# EAGLE design Spectrum_Shield (EAGLE 7.1.0)
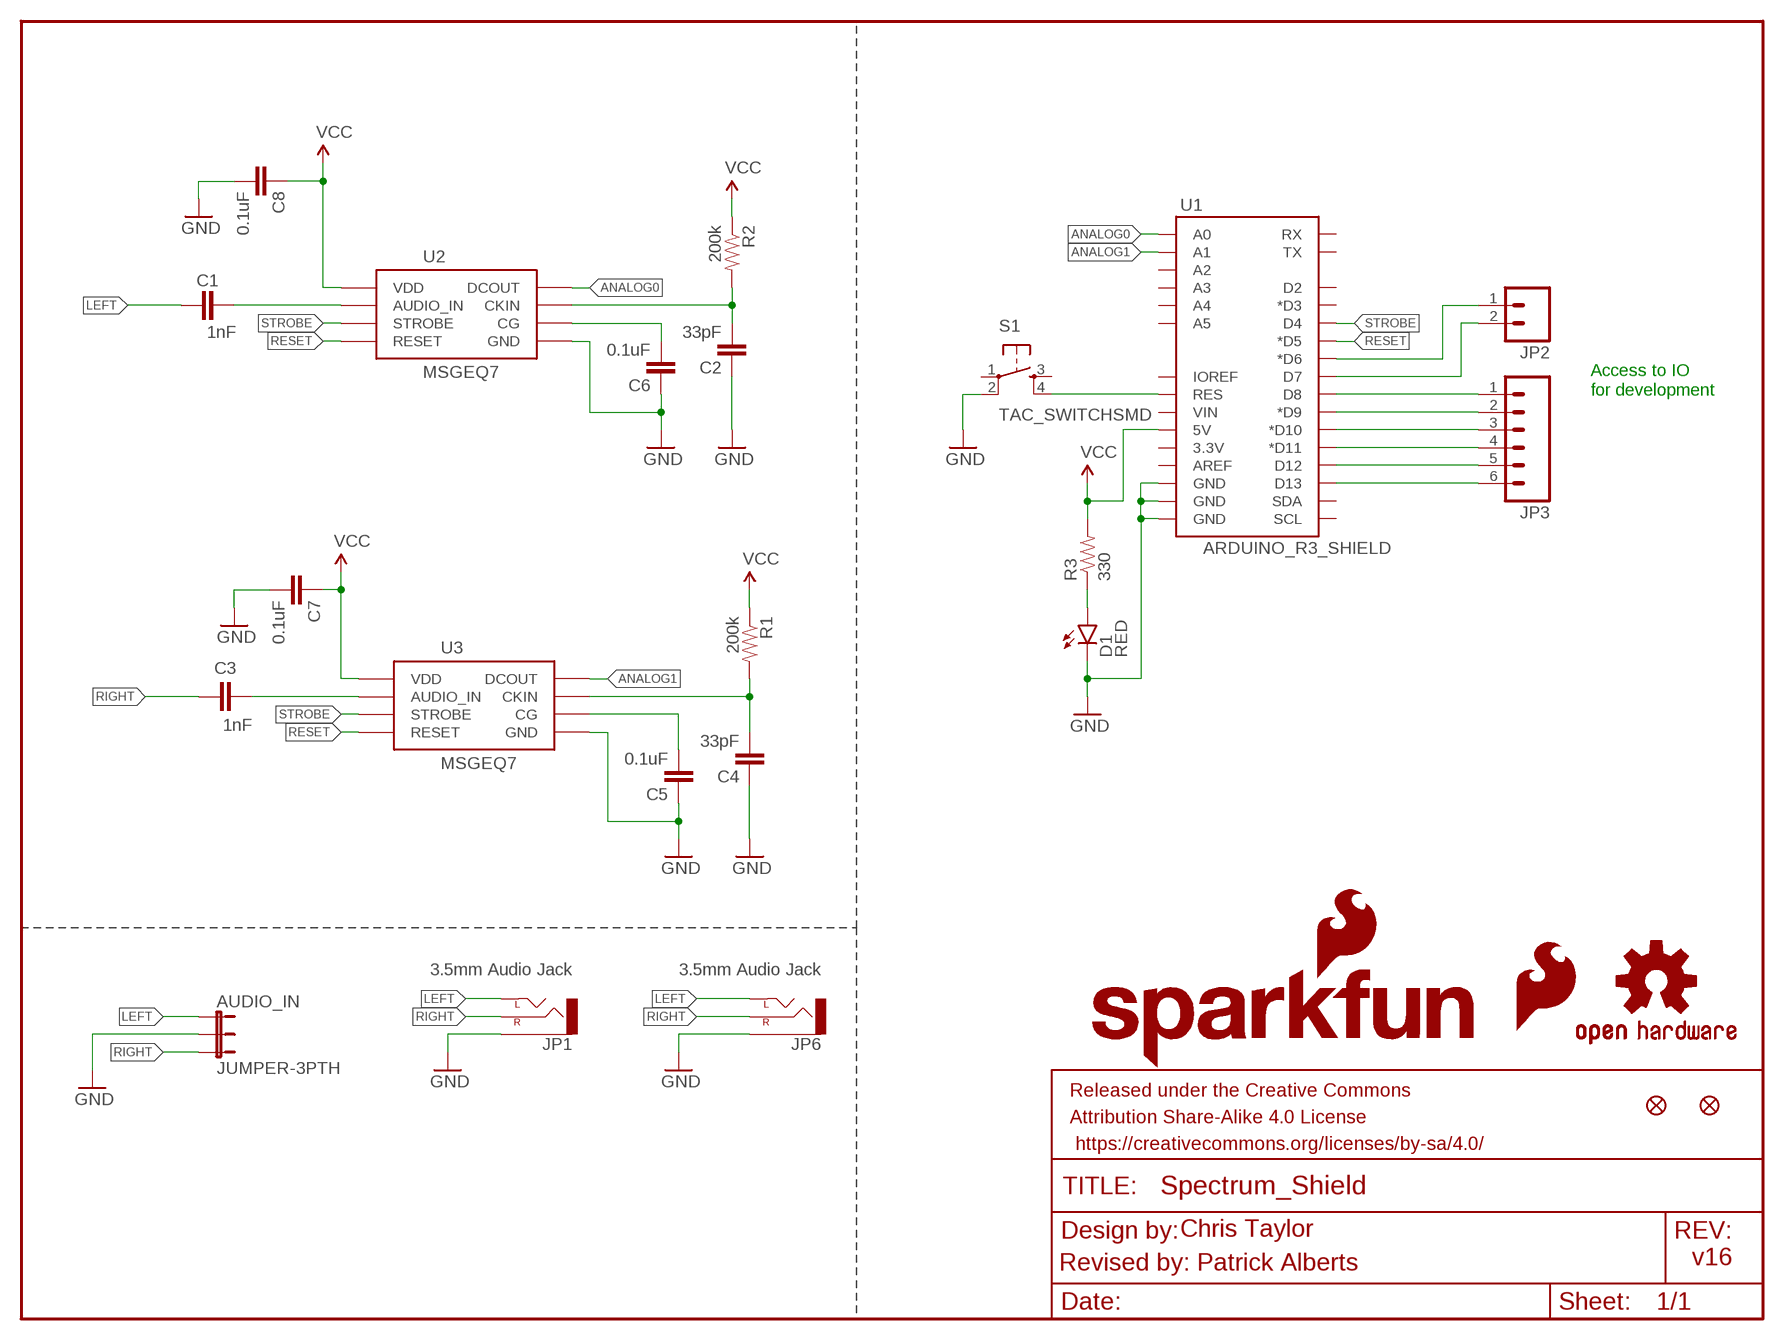
[diagram p0: schematic, sheet 1]

## Parts
AUDIO_IN  JUMPER-3PTH  [1X03]
C1  1nF  1NF/1000PF-50V-10%(0603)  [0603-CAP]
C2  33pF  33PF-50V-5%-(0603)  [0603-CAP]
C3  1nF  1NF/1000PF-50V-10%(0603)  [0603-CAP]
C4  33pF  33PF-50V-5%-(0603)  [0603-CAP]
C5  0.1uF  0.1UF-25V(+80/-20%)(0603)  [0603-CAP]
C6  0.1uF  0.1UF-25V(+80/-20%)(0603)  [0603-CAP]
C7  0.1uF  0.1UF-25V(+80/-20%)(0603)  [0603-CAP]
C8  0.1uF  0.1UF-25V(+80/-20%)(0603)  [0603-CAP]
D1  RED  LED-RED0603  [LED-0603]
FRAME1  FRAME-LETTER  [CREATIVE_COMMONS]
JP1  3.5mm Audio Jack  AUDIO-JACKSMD2  [AUDIO-JACK-3.5MM-SMD]
JP2  M02PTH  [1X02]
JP3  M06SIP  [1X06]
JP4  FIDUCIAL1X2  [FIDUCIAL-1X2]
JP5  FIDUCIAL1X2  [FIDUCIAL-1X2]
JP6  3.5mm Audio Jack  AUDIO-JACKSMD2  [AUDIO-JACK-3.5MM-SMD]
LOGO1  OSHW-LOGOM  [OSHW-LOGO-M]
LOGO2  SFE_LOGO_FLAME.2_INCH  [SFE_LOGO_FLAME_.2]
LOGO3  SFE_LOGO_NAME_FLAME.1_INCH  [SFE_LOGO_NAME_FLAME_.1]
R1  200k  200KOHM1/10W1%(0603)200K  [0603-RES]
R2  200k  220KOHM1/10W1%(0603)  [0603-RES]
R3  330  330OHM1/10W1%(0603)  [0603-RES]
S1  TAC_SWITCHSMD  [TACTILE-SWITCH-SMD]
U1  ARDUINO_R3_SHIELD  [UNO_R3_SHIELD]
U2  MSGEQ7SOIC  [SOIC8]
U3  MSGEQ7SOIC  [SOIC8]

## Nets
ANALOG0: U1.A0 U2.3(DCOUT)
ANALOG1: U1.A1 U3.3(DCOUT)
GND: AUDIO_IN.2 C2.1 C4.1 C5.1 C6.1 C7.2 C8.2 D1.C JP1.SLEEVE JP6.SLEEVE S1.2 U1.GND@0(GND) U1.GND@1(GND) U1.GND@2(GND) U2.2(GND) U3.2(GND)
LEFT: AUDIO_IN.1 C1.1 JP1.TIP(LEFT) JP6.TIP(LEFT)
N$1: C1.2 U2.5(AUDIO_IN)
N$2: C3.2 U3.5(AUDIO_IN)
N$3: C4.2 R1.2 U3.8(CKIN)
N$4: C2.2 R2.2 U2.8(CKIN)
N$5: C5.2 U3.6(CG)
N$6: C6.2 U2.6(CG)
N$7: D1.A R3.1
N$8: JP2.1 U1.D6(*D6)
N$9: JP2.2 U1.D7
N$10: JP3.1 U1.D8
N$11: JP3.2 U1.D9(*D9)
N$12: JP3.3 U1.D10(*D10)
N$13: JP3.4 U1.D11(*D11)
N$14: JP3.5 U1.D12
N$15: JP3.6 U1.D13
N$227: S1.4 U1.RES
RESET: U1.D5(*D5) U2.7(RESET) U3.7(RESET)
RIGHT: AUDIO_IN.3 C3.1 JP1.RING(RIGHT) JP6.RING(RIGHT)
STROBE: U1.D4 U2.4(STROBE) U3.4(STROBE)
VCC: C7.1 C8.1 R1.1 R2.1 R3.2 U1.5V U2.1(VDD) U3.1(VDD)
Unconnected: S1.1 S1.3 U1.3.3V U1.A2 U1.A3 U1.A4 U1.A5 U1.AREF U1.D2 U1.D3(*D3) U1.IOREF U1.RX U1.SCL U1.SDA U1.TX U1.VIN

## Notes on the sheet
- Access to IO
- for development
- Chris Taylor
- Revised by: Patrick Alberts | v16

## Library data of the parts
AUDIO_IN = SparkFun:JUMPER-3
C1 C3 = SparkFun-Capacitors:1NF/1000PF-50V-10%(0603): CAP-07886; PROD_ID: CAP-07886
C2 C4 = SparkFun-Capacitors:33PF-50V-5%-(0603): CAP-10142; PROD_ID: CAP-10142
C5-C8 = SparkFun-Capacitors:0.1UF-25V(+80/-20%)(0603): CAP-00810 Ceramic Standard decoupling cap; PROD_ID: CAP-00810
D1 = SparkFun-LED:LED-RED: Assorted Red LEDs LilyPad 1206- DIO-09912 1206- DIO-00809 0603- DIO-00819 "SMART" means more efficient and expensive; PROD_ID: DIO-00819
FRAME1 = SparkFun-Aesthetics:FRAME-LETTER: Schematic Frame Standard 8.5x11 US Letter frame
JP1 JP6 = SparkFun-Connectors:AUDIO-JACK: 3.5mm Audio Jack Simple 3.5mm common PCB mount audio jack. Variant PTH is our storefront SKU PRT-08032; PROD_ID: CONN-10353
JP2 = SparkFun:M02: Header 2 Standard 2-pin 0.1" header. Use with straight break away headers (SKU : PRT-00116), right angle break away headers (PRT-00553), swiss pins (PRT-00743), machine pins (PRT-00117), and female headers (PRT-00115). Molex polarized connector foot print use with SKU : PRT-08233 with associated crimp pins and housings.
JP3 = SparkFun:M06: Header 6 Standard 6-pin 0.1" header. Use with straight break away headers (SKU : PRT-00116), right angle break away headers (PRT-00553), swiss pins (PRT-00743), machine pins (PRT-00117), and female headers (PRT-00115). Molex polarized connector foot print use with SKU : PRT-08094 with associated crimp pins and housings. NOTES ON THE VARIANTS LOCK and LOCK_LONGPADS... This footprint was designed to help hold the alignment of a through-hole component (i.e. 6-pin header) while soldering it into place. You may notice that each hole has been shifted either up or down by 0.005 of an inch from it's more standard position (which is a perfectly straight line). This slight alteration caused the pins (the squares in the middle) to touch the edges of the holes. Because they are alternating, it causes a "brace" to hold the component in place. 0.005 has proven to be the perfect amount of "off-center" position when using our standard breakaway headers. Although looks a little odd when you look at the bare footprint, once you have a header in there, the alteration is very hard to notice. Also, if you push a header all the way into place, it is covered up entirely on the bottom side. This idea of altering the position of holes to aid alignment will be further integrated into the Sparkfun Library for other footprints. It can help hold any component with 3 or more connection pins.
JP4 JP5 = SparkFun:FIDUCIAL: Fiducial Alignment Points Various fiducial points for machine vision alignment.
LOGO1 = SparkFun-Aesthetics:OSHW-LOGO: Open Source Hardware Logo This logo indicates the piece of hardware it is found on incorporates a OSHW license and/or adheres to the definition of open source hardware found here: http://freedomdefined.org/OSHW
LOGO2 = SparkFun-Aesthetics:SFE_LOGO_FLAME: SFE Logo, flame only This is the SparkFun flame logo. The logo on the schematic will always be the same size; the package variant is the height of the flame. Default layer for the logo on the board is tSilk.
LOGO3 = SparkFun-Aesthetics:SFE_LOGO_NAME_FLAME: SFE Logo, name and flame This is the SparkFun full logo. The logo on the schematic will always be the same size; the package variant is the height of the flame part of the logo. Default layer for the logo on the board is tSilk.
R1 = SparkFun-Resistors:200KOHM1/10W1%(0603): RES-09385; PROD_ID: RES-09385
R2 = SparkFun-Resistors:220KOHM1/10W1%(0603): RES-08969; PROD_ID: RES-08969; VALUE: 220k
R3 = SparkFun-Resistors:330OHM1/10W1%(0603): RES-00818; PROD_ID: RES-00818
S1 = SparkFun-Retired:TAC_SWITCH: Momentary Switch Button commonly used for reset or general input. Spark Fun Electronics SKU : COM-00097 SMT- SWCH-08247; PROD_ID: SWCH-08247
U1 = SparkFun-Boards:ARDUINO_R3_SHIELD: Shield form compatible with the Arduino Uno R3.
U2 U3 = SparkFun-AnalogIC:MSGEQ7: 7-band graphic equalizer; PROD_ID: IC-10141

## Board
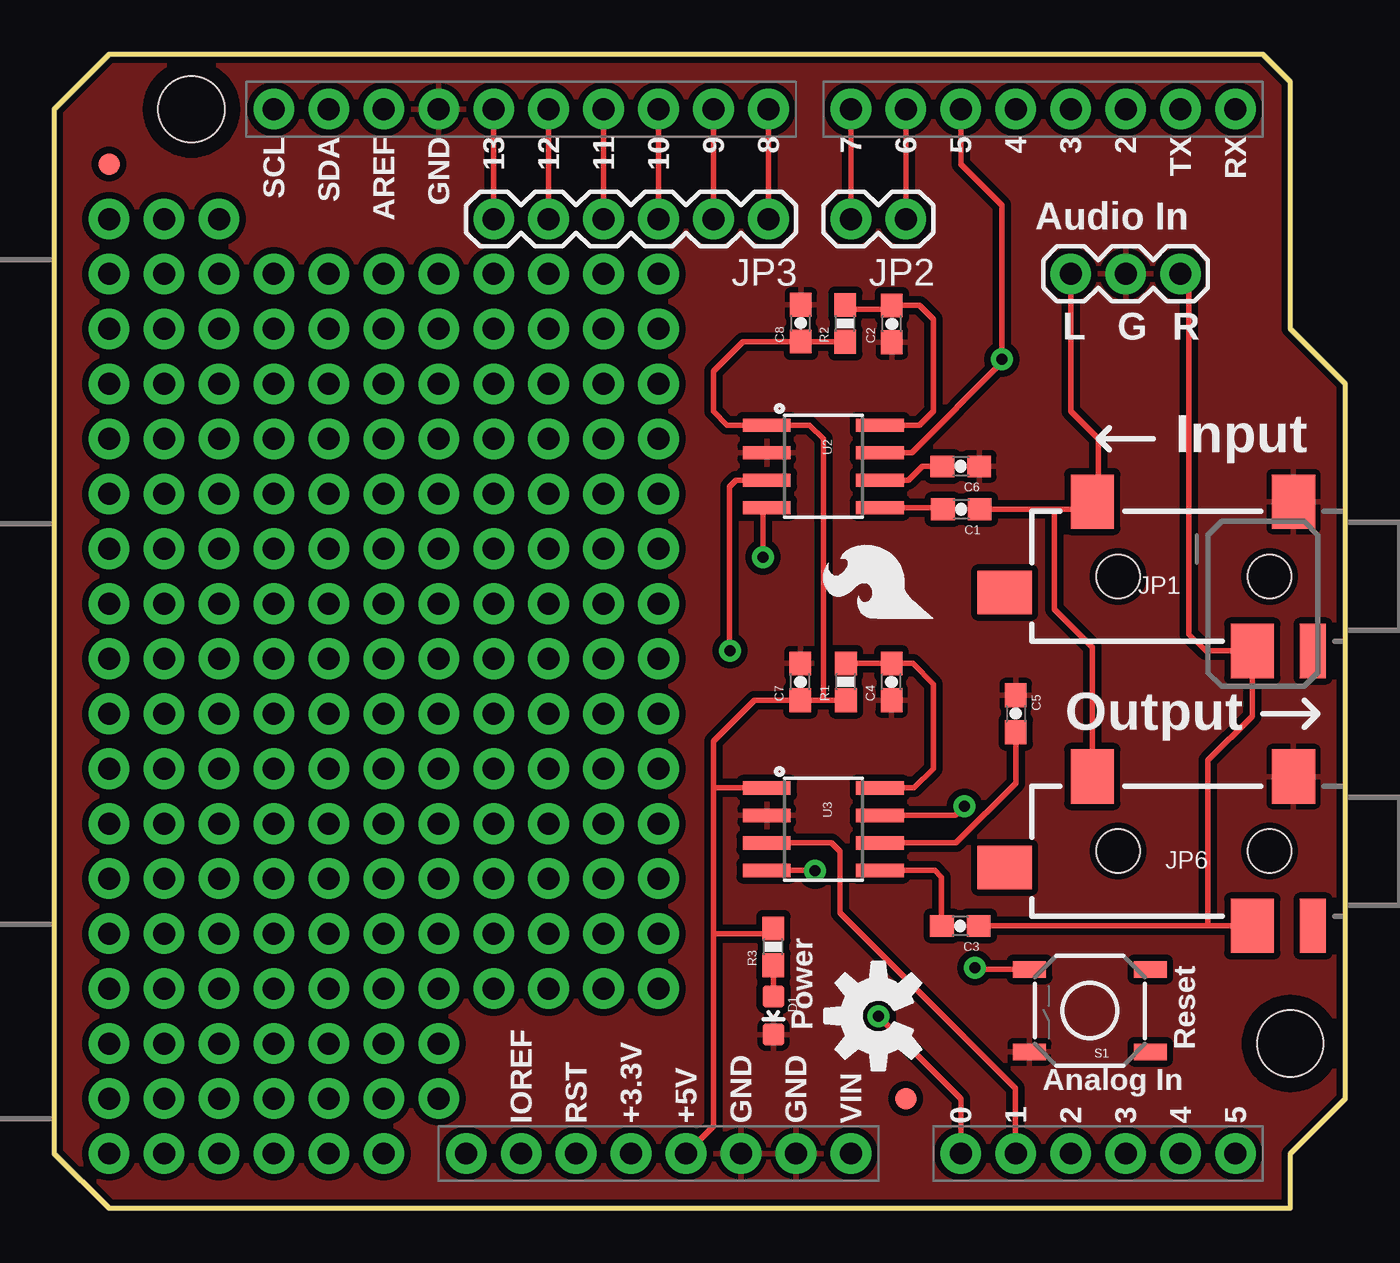
[diagram p1: board, top side]
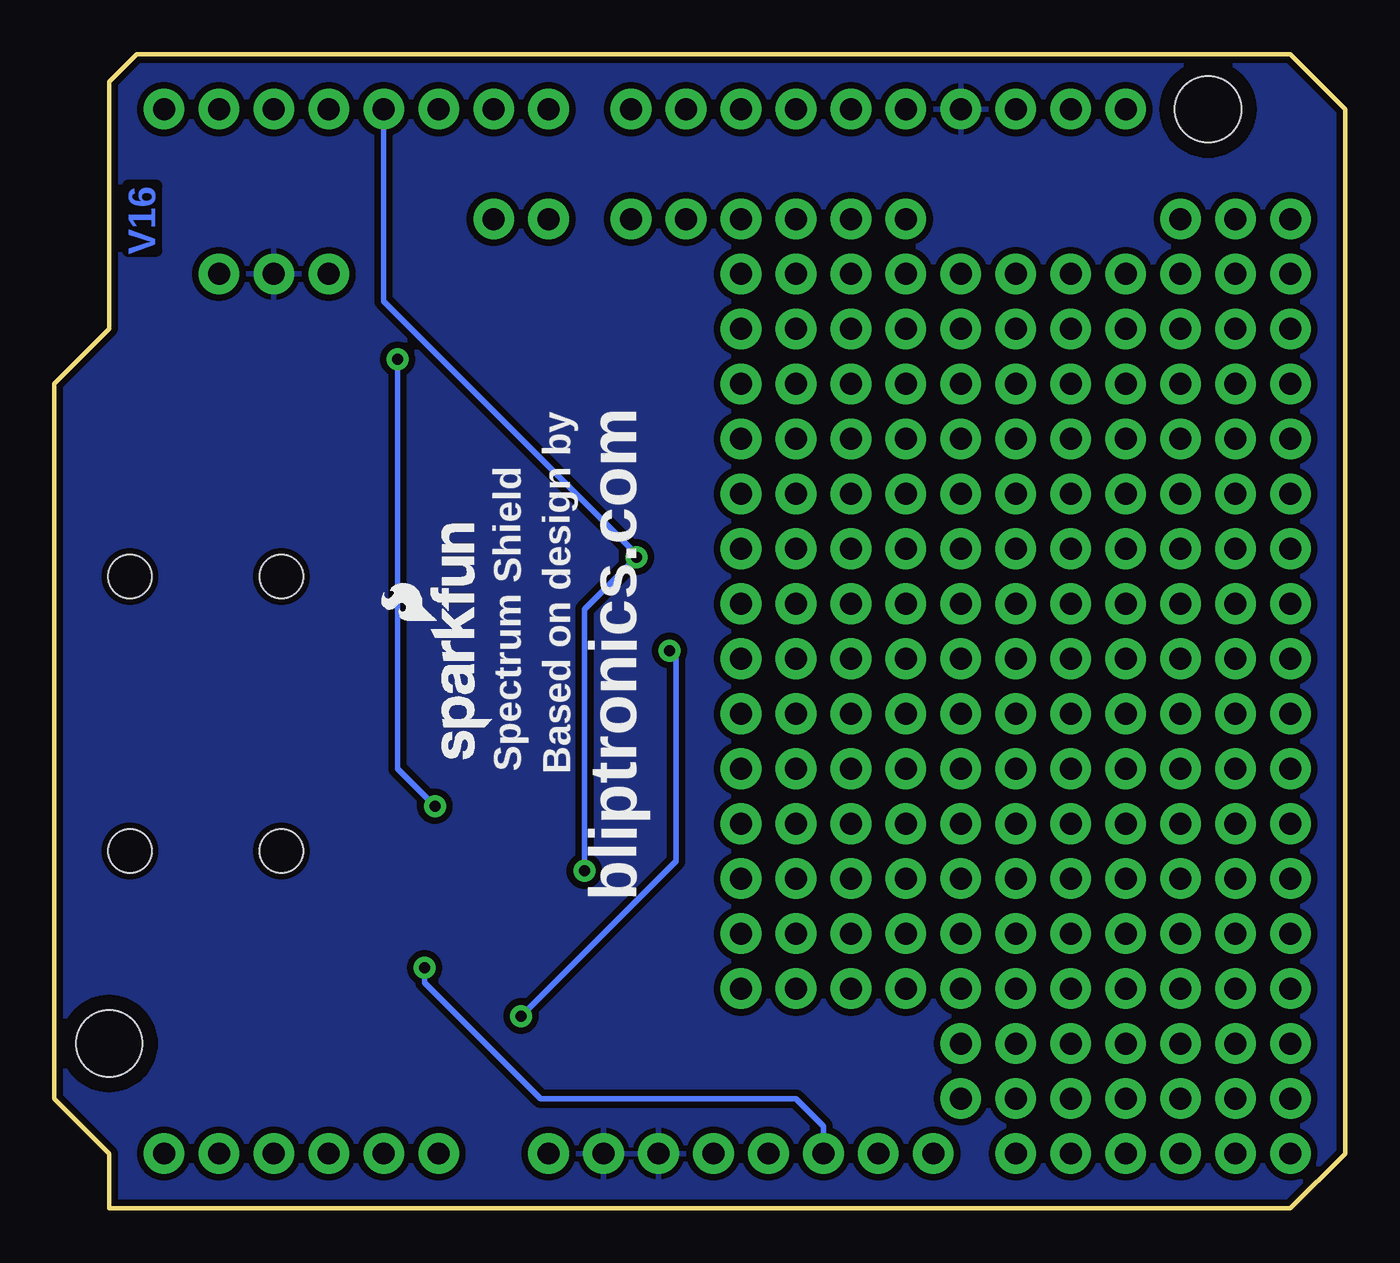
[diagram p2: board, bottom side, seen from below]

Size 59.69 x 53.34 mm. Coordinates in mm from the lower left corner, seen from the top.
Outline: 2.54,0 57.15,0 57.15,2.54 59.69,5.08 59.69,38.1 57.15,40.64 57.15,52.07 55.88,53.34 2.54,53.34 0,50.8 0,2.54 2.54,0
Copper layers (1*16): Top 0.035mm / dielectric 1.5mm / Bottom 0.035mm
Design rules "SparkFun-2-layer": minimum track width 7mil, minimum drill 15mil, track to track 8mil, track to pad 8mil, pad to pad 8mil, via to via 8mil, smd to smd 8mil, copper to edge 8mil, drill to drill 8mil, minimum pad ring 12mil, minimum via ring 10mil, stop-mask expansion 4mil, vias tented up to drill 20mil, thermal gap 10mil

### Footprints (pad centres in the part's own frame; a part is rotated, then mirrored left to right if it is on the bottom)
1X03 = drill 1.016 pad 1.88: 1 0,0; 2 2.54,0; 3 5.08,0
0603-CAP = smd 1.1 x 1: 1 -0.85,0; 2 0.85,0
LED-0603 = smd 1 x 1: A 0,-0.877; C 0,0.877
AUDIO-JACK-3.5MM-SMD = smd 2 x 2.5: RING 4.3,3.45; SLEEVE 2.4,-3.45; TIP 11.7,-3.45 | smd 1.2 x 2.5: RSH 1.5,3.45 | smd 2.5 x 2: TSH 15.75,0.75 | hole 2: 3.5,0; 10.5,0
1X02 = drill 1.016 pad 1.88: 1 0,0; 2 2.54,0
1X06 = drill 1.016 pad 1.88: 1 0,0; 2 2.54,0; 3 5.08,0; 4 7.62,0; 5 10.16,0; 6 12.7,0
FIDUCIAL-1X2 = smd 1 x 1: 1 0,0
0603-RES = smd 1.1 x 1: 1 -0.85,0; 2 0.85,0
TACTILE-SWITCH-SMD = smd 1.524 x 0.762: 1 -2.794,1.905; 2 2.794,1.905; 3 -2.794,-1.905; 4 2.794,-1.905
UNO_R3_SHIELD = drill 1.016 pad 1.88: 3.3V 50.8,26.67; 5V 50.8,29.21; A0 50.8,41.91; A1 50.8,44.45; A2 50.8,46.99; A3 50.8,49.53; A4 50.8,52.07; A5 50.8,54.61; AREF 2.54,15.24; D2 2.54,49.53; D3 2.54,46.99; D4 2.54,44.45; D5 2.54,41.91; D6 2.54,39.37; D7 2.54,36.83; D8 2.54,33.02; D9 2.54,30.48; D10 2.54,27.94; D11 2.54,25.4; D12 2.54,22.86; D13 2.54,20.32; GND@0 50.8,31.75; GND@1 50.8,34.29; GND@2 2.54,17.78; IOREF 50.8,21.59; NC 50.8,19.05; RES 50.8,24.13; RX 2.54,54.61; SCL 2.54,10.16; SDA 2.54,12.7; TX 2.54,52.07; VIN 50.8,36.83
SOIC8 = smd 0.61 x 2.21: 1 -1.905,-2.616; 2 -0.635,-2.616; 3 0.635,-2.616; 4 1.905,-2.616; 5 1.905,2.616; 6 0.635,2.616; 7 -0.635,2.616; 8 -1.905,2.616
STAND-OFF-TIGHT = hole 3.048: 0,0

### Placement (x,y rotation side)
AUDIO_IN  46.99,43.18 0 top
C1  41.94,32.31 180 top
C2  38.72,40.87 90 top
C3  41.88,13.06 180 top
C4  38.71,24.33 90 top
C5  44.45,22.86 270 top
C6  41.91,34.29 180 top
C7  34.49,24.33 90 top
C8  34.52,40.91 90 top
D1  33.25,8.92 180 top
FRAME1  8.89,-15.24 0 top  (outside the outline)
JP1  59.69,29.21 180 top
JP2  39.37,45.72 180 top
JP3  33.02,45.72 180 top
JP4  39.37,5.08 0 top
JP5  2.54,48.26 0 top
JP6  59.69,16.51 180 top
LOGO1  38.1,8.89 90 top
LOGO2  40.89,26.92 90 top
LOGO3  39.37,20.32 90 bottom
R1  36.6,24.33 90 top
R2  36.58,40.89 90 top
R3  33.25,12.09 90 top
S1  47.88,9.14 180 top
U1  0,53.34 270 top
U2  35.56,34.29 270 top
U3  35.56,17.53 270 top
U$1  [STAND-OFF-TIGHT]  57.15,7.62 0 top
U$3  [STAND-OFF-TIGHT]  6.35,50.8 0 top

### Tracks (layer width: path | path; a pad name or v marks a point on that pad's centre or on a via)
ANALOG0  (via drill 0.51)
  Top 0.254: U2.3 31.52,33.66 31.22,33.35 31.22,25.81 v31.24,25.78 | U1.A0 41.91,5.08 v38.1,8.89
  Bottom 0.254: v31.24,25.78 30.94,25.48 30.94,16.05 v38.1,8.89
ANALOG1
  Top 0.254: U3.3 35.94,16.89 36.32,16.51 36.32,13.66 44.42,5.56 44.42,2.56 U1.A1
GND
  pour Top (isolate 0.305): 2.54,0 57.15,0 57.15,2.54 59.69,5.08 59.69,38.1 57.15,40.64 57.15,52.07 55.88,53.34 2.54,53.34 0,50.8 0,2.54
  pour Bottom (isolate 0.305): 2.54,53.34 0,50.8 0,2.54 2.54,0 57.15,0 57.15,2.54 59.69,5.08 59.69,38.1 57.15,40.64 57.15,52.07 55.88,53.34
LEFT
  Top 0.254: AUDIO_IN.1 46.99,36.83 48.26,35.56 48.26,32.93 JP1.TIP 47.64,32.31 46.23,32.31 | C1.1 46.23,32.31 | JP6.TIP 47.99,25.92 46.23,27.69 46.23,32.31
N$1
  Top 0.254: U2.5 41.01,32.38 C1.2
N$2
  Top 0.254: U3.5 40.72,15.62 41.02,15.32 C3.2
N$3
  Top 0.254: U3.8 39.75,19.43 40.64,20.32 40.64,24.23 39.69,25.18 C4.2 R1.2
N$4
  Top 0.254: R2.2 36.78,41.54 38.55,41.54 C2.2 40.01,41.73 40.64,41.09 40.64,36.83 40.01,36.2 U2.8
N$5
  Top 0.254: U3.6 41.68,16.89 44.45,19.66 C5.2
N$6
  Top 0.254: U2.6 39.5,33.66 40.13,34.29 C6.2
N$7
  Top 0.254: D1.A R3.1
N$8
  Top 0.254: JP2.1 U1.D6
N$9
  Top 0.254: JP2.2 U1.D7
N$10
  Top 0.254: JP3.1 U1.D8
N$11
  Top 0.254: JP3.2 U1.D9
N$12
  Top 0.254: JP3.3 U1.D10
N$13
  Top 0.254: JP3.4 U1.D11
N$14
  Top 0.254: JP3.5 U1.D12
N$15
  Top 0.254: JP3.6 U1.D13
N$16  (via drill 1.02 pad 1.88)
  other vias: 2.54,43.18
N$17  (via drill 1.02 pad 1.88)
  other vias: 2.54,40.64
N$18  (via drill 1.02 pad 1.88)
  other vias: 2.54,38.1
N$19  (via drill 1.02 pad 1.88)
  other vias: 2.54,35.56
N$20  (via drill 1.02 pad 1.88)
  other vias: 2.54,33.02
N$21  (via drill 1.02 pad 1.88)
  other vias: 2.54,30.48
N$22  (via drill 1.02 pad 1.88)
  other vias: 2.54,27.94
N$23  (via drill 1.02 pad 1.88)
  other vias: 2.54,25.4
N$24  (via drill 1.02 pad 1.88)
  other vias: 2.54,22.86
N$25  (via drill 1.02 pad 1.88)
  other vias: 2.54,20.32
N$26  (via drill 1.02 pad 1.88)
  other vias: 2.54,17.78
N$27  (via drill 1.02 pad 1.88)
  other vias: 2.54,15.24
N$28  (via drill 1.02 pad 1.88)
  other vias: 2.54,12.7
N$29  (via drill 1.02 pad 1.88)
  other vias: 2.54,10.16
N$30  (via drill 1.02 pad 1.88)
  other vias: 2.54,7.62
N$31  (via drill 1.02 pad 1.88)
  other vias: 2.54,5.08
N$32  (via drill 1.02 pad 1.88)
  other vias: 2.54,2.54
N$33  (via drill 1.02 pad 1.88)
  other vias: 5.08,43.18
N$34  (via drill 1.02 pad 1.88)
  other vias: 5.08,40.64
N$35  (via drill 1.02 pad 1.88)
  other vias: 5.08,38.1
N$36  (via drill 1.02 pad 1.88)
  other vias: 5.08,35.56
N$37  (via drill 1.02 pad 1.88)
  other vias: 5.08,33.02
N$38  (via drill 1.02 pad 1.88)
  other vias: 5.08,30.48
N$39  (via drill 1.02 pad 1.88)
  other vias: 5.08,27.94
N$40  (via drill 1.02 pad 1.88)
  other vias: 5.08,25.4
N$41  (via drill 1.02 pad 1.88)
  other vias: 5.08,22.86
N$42  (via drill 1.02 pad 1.88)
  other vias: 5.08,20.32
N$43  (via drill 1.02 pad 1.88)
  other vias: 5.08,17.78
N$44  (via drill 1.02 pad 1.88)
  other vias: 5.08,15.24
N$45  (via drill 1.02 pad 1.88)
  other vias: 5.08,12.7
N$46  (via drill 1.02 pad 1.88)
  other vias: 5.08,10.16
N$47  (via drill 1.02 pad 1.88)
  other vias: 5.08,7.62
N$48  (via drill 1.02 pad 1.88)
  other vias: 5.08,5.08
N$49  (via drill 1.02 pad 1.88)
  other vias: 5.08,2.54
N$50  (via drill 1.02 pad 1.88)
  other vias: 7.62,43.18
N$51  (via drill 1.02 pad 1.88)
  other vias: 7.62,40.64
N$52  (via drill 1.02 pad 1.88)
  other vias: 7.62,38.1
N$53  (via drill 1.02 pad 1.88)
  other vias: 7.62,35.56
N$54  (via drill 1.02 pad 1.88)
  other vias: 7.62,33.02
N$55  (via drill 1.02 pad 1.88)
  other vias: 7.62,30.48
N$56  (via drill 1.02 pad 1.88)
  other vias: 7.62,27.94
N$57  (via drill 1.02 pad 1.88)
  other vias: 7.62,25.4
N$58  (via drill 1.02 pad 1.88)
  other vias: 7.62,22.86
N$59  (via drill 1.02 pad 1.88)
  other vias: 7.62,20.32
N$60  (via drill 1.02 pad 1.88)
  other vias: 7.62,17.78
N$61  (via drill 1.02 pad 1.88)
  other vias: 7.62,15.24
N$62  (via drill 1.02 pad 1.88)
  other vias: 7.62,12.7
N$63  (via drill 1.02 pad 1.88)
  other vias: 7.62,10.16
N$64  (via drill 1.02 pad 1.88)
  other vias: 7.62,7.62
N$65  (via drill 1.02 pad 1.88)
  other vias: 7.62,5.08
N$66  (via drill 1.02 pad 1.88)
  other vias: 7.62,2.54
N$67  (via drill 1.02 pad 1.88)
  other vias: 10.16,43.18
N$68  (via drill 1.02 pad 1.88)
  other vias: 10.16,40.64
N$69  (via drill 1.02 pad 1.88)
  other vias: 10.16,38.1
N$70  (via drill 1.02 pad 1.88)
  other vias: 10.16,35.56
N$71  (via drill 1.02 pad 1.88)
  other vias: 10.16,33.02
N$72  (via drill 1.02 pad 1.88)
  other vias: 10.16,30.48
N$73  (via drill 1.02 pad 1.88)
  other vias: 10.16,27.94
N$74  (via drill 1.02 pad 1.88)
  other vias: 10.16,25.4
N$75  (via drill 1.02 pad 1.88)
  other vias: 10.16,22.86
N$76  (via drill 1.02 pad 1.88)
  other vias: 10.16,20.32
N$77  (via drill 1.02 pad 1.88)
  other vias: 10.16,17.78
N$78  (via drill 1.02 pad 1.88)
  other vias: 10.16,15.24
N$79  (via drill 1.02 pad 1.88)
  other vias: 10.16,12.7
N$80  (via drill 1.02 pad 1.88)
  other vias: 10.16,10.16
N$81  (via drill 1.02 pad 1.88)
  other vias: 10.16,7.62
N$82  (via drill 1.02 pad 1.88)
  other vias: 10.16,5.08
N$83  (via drill 1.02 pad 1.88)
  other vias: 10.16,2.54
N$84  (via drill 1.02 pad 1.88)
  other vias: 12.7,43.18
N$85  (via drill 1.02 pad 1.88)
  other vias: 12.7,40.64
N$86  (via drill 1.02 pad 1.88)
  other vias: 12.7,38.1
N$87  (via drill 1.02 pad 1.88)
  other vias: 12.7,35.56
N$88  (via drill 1.02 pad 1.88)
  other vias: 12.7,33.02
N$89  (via drill 1.02 pad 1.88)
  other vias: 12.7,30.48
N$90  (via drill 1.02 pad 1.88)
  other vias: 12.7,27.94
N$91  (via drill 1.02 pad 1.88)
  other vias: 12.7,25.4
N$92  (via drill 1.02 pad 1.88)
  other vias: 12.7,22.86
N$93  (via drill 1.02 pad 1.88)
  other vias: 12.7,20.32
N$94  (via drill 1.02 pad 1.88)
  other vias: 12.7,17.78
N$95  (via drill 1.02 pad 1.88)
  other vias: 12.7,15.24
N$96  (via drill 1.02 pad 1.88)
  other vias: 12.7,12.7
N$97  (via drill 1.02 pad 1.88)
  other vias: 12.7,10.16
N$98  (via drill 1.02 pad 1.88)
  other vias: 12.7,7.62
N$99  (via drill 1.02 pad 1.88)
  other vias: 12.7,5.08
N$100  (via drill 1.02 pad 1.88)
  other vias: 12.7,2.54
N$101  (via drill 1.02 pad 1.88)
  other vias: 15.24,43.18
N$102  (via drill 1.02 pad 1.88)
  other vias: 15.24,40.64
N$103  (via drill 1.02 pad 1.88)
  other vias: 15.24,38.1
N$104  (via drill 1.02 pad 1.88)
  other vias: 15.24,35.56
N$105  (via drill 1.02 pad 1.88)
  other vias: 15.24,33.02
N$106  (via drill 1.02 pad 1.88)
  other vias: 15.24,30.48
N$107  (via drill 1.02 pad 1.88)
  other vias: 15.24,27.94
N$108  (via drill 1.02 pad 1.88)
  other vias: 15.24,25.4
N$109  (via drill 1.02 pad 1.88)
  other vias: 15.24,22.86
N$110  (via drill 1.02 pad 1.88)
  other vias: 15.24,20.32
N$111  (via drill 1.02 pad 1.88)
  other vias: 15.24,17.78
N$112  (via drill 1.02 pad 1.88)
  other vias: 15.24,15.24
N$113  (via drill 1.02 pad 1.88)
  other vias: 15.24,12.7
N$114  (via drill 1.02 pad 1.88)
  other vias: 15.24,10.16
N$115  (via drill 1.02 pad 1.88)
  other vias: 15.24,7.62
N$116  (via drill 1.02 pad 1.88)
  other vias: 15.24,5.08
N$117  (via drill 1.02 pad 1.88)
  other vias: 15.24,2.54
N$118  (via drill 1.02 pad 1.88)
  other vias: 17.78,43.18
N$119  (via drill 1.02 pad 1.88)
  other vias: 17.78,40.64
N$120  (via drill 1.02 pad 1.88)
  other vias: 17.78,38.1
N$121  (via drill 1.02 pad 1.88)
  other vias: 17.78,35.56
N$122  (via drill 1.02 pad 1.88)
  other vias: 17.78,33.02
N$123  (via drill 1.02 pad 1.88)
  other vias: 17.78,30.48
N$124  (via drill 1.02 pad 1.88)
  other vias: 17.78,27.94
N$125  (via drill 1.02 pad 1.88)
  other vias: 17.78,25.4
N$126  (via drill 1.02 pad 1.88)
  other vias: 17.78,22.86
N$127  (via drill 1.02 pad 1.88)
  other vias: 17.78,20.32
N$128  (via drill 1.02 pad 1.88)
  other vias: 17.78,17.78
N$129  (via drill 1.02 pad 1.88)
  other vias: 17.78,15.24
N$130  (via drill 1.02 pad 1.88)
  other vias: 17.78,12.7
N$131  (via drill 1.02 pad 1.88)
  other vias: 17.78,10.16
N$132  (via drill 1.02 pad 1.88)
  other vias: 17.78,7.62
N$133  (via drill 1.02 pad 1.88)
  other vias: 17.78,5.08
N$135  (via drill 1.02 pad 1.88)
  other vias: 20.32,43.18
N$136  (via drill 1.02 pad 1.88)
  other vias: 20.32,40.64
N$137  (via drill 1.02 pad 1.88)
  other vias: 20.32,38.1
N$138  (via drill 1.02 pad 1.88)
  other vias: 20.32,35.56
N$139  (via drill 1.02 pad 1.88)
  other vias: 20.32,33.02
N$140  (via drill 1.02 pad 1.88)
  other vias: 20.32,30.48
N$141  (via drill 1.02 pad 1.88)
  other vias: 20.32,27.94
N$142  (via drill 1.02 pad 1.88)
  other vias: 20.32,25.4
N$143  (via drill 1.02 pad 1.88)
  other vias: 20.32,22.86
N$144  (via drill 1.02 pad 1.88)
  other vias: 20.32,20.32
N$145  (via drill 1.02 pad 1.88)
  other vias: 20.32,17.78
N$146  (via drill 1.02 pad 1.88)
  other vias: 20.32,15.24
N$147  (via drill 1.02 pad 1.88)
  other vias: 20.32,12.7
N$148  (via drill 1.02 pad 1.88)
  other vias: 20.32,10.16
N$152  (via drill 1.02 pad 1.88)
  other vias: 22.86,43.18
N$153  (via drill 1.02 pad 1.88)
  other vias: 22.86,40.64
N$154  (via drill 1.02 pad 1.88)
  other vias: 22.86,38.1
N$155  (via drill 1.02 pad 1.88)
  other vias: 22.86,35.56
N$156  (via drill 1.02 pad 1.88)
  other vias: 22.86,33.02
N$157  (via drill 1.02 pad 1.88)
  other vias: 22.86,30.48
N$158  (via drill 1.02 pad 1.88)
  other vias: 22.86,27.94
N$159  (via drill 1.02 pad 1.88)
  other vias: 22.86,25.4
N$160  (via drill 1.02 pad 1.88)
  other vias: 22.86,22.86
N$161  (via drill 1.02 pad 1.88)
  other vias: 22.86,20.32
N$162  (via drill 1.02 pad 1.88)
  other vias: 22.86,17.78
N$163  (via drill 1.02 pad 1.88)
  other vias: 22.86,15.24
N$164  (via drill 1.02 pad 1.88)
  other vias: 22.86,12.7
N$165  (via drill 1.02 pad 1.88)
  other vias: 22.86,10.16
N$166  (via drill 1.02 pad 1.88)
  other vias: 2.54,45.72
N$167  (via drill 1.02 pad 1.88)
  other vias: 5.08,45.72
N$168  (via drill 1.02 pad 1.88)
  other vias: 7.62,45.72
N$169  (via drill 1.02 pad 1.88)
  other vias: 25.4,43.18
N$170  (via drill 1.02 pad 1.88)
  other vias: 25.4,40.64
N$171  (via drill 1.02 pad 1.88)
  other vias: 25.4,38.1
N$172  (via drill 1.02 pad 1.88)
  other vias: 25.4,35.56
N$173  (via drill 1.02 pad 1.88)
  other vias: 25.4,33.02
N$174  (via drill 1.02 pad 1.88)
  other vias: 25.4,30.48
N$175  (via drill 1.02 pad 1.88)
  other vias: 25.4,27.94
N$176  (via drill 1.02 pad 1.88)
  other vias: 25.4,25.4
N$177  (via drill 1.02 pad 1.88)
  other vias: 25.4,22.86
N$178  (via drill 1.02 pad 1.88)
  other vias: 25.4,20.32
N$179  (via drill 1.02 pad 1.88)
  other vias: 25.4,17.78
N$180  (via drill 1.02 pad 1.88)
  other vias: 25.4,15.24
N$181  (via drill 1.02 pad 1.88)
  other vias: 25.4,12.7
N$182  (via drill 1.02 pad 1.88)
  other vias: 25.4,10.16
N$183  (via drill 1.02 pad 1.88)
  other vias: 27.94,43.18
N$184  (via drill 1.02 pad 1.88)
  other vias: 27.94,40.64
N$185  (via drill 1.02 pad 1.88)
  other vias: 27.94,38.1
N$186  (via drill 1.02 pad 1.88)
  other vias: 27.94,35.56
N$187  (via drill 1.02 pad 1.88)
  other vias: 27.94,33.02
N$188  (via drill 1.02 pad 1.88)
  other vias: 27.94,30.48
N$189  (via drill 1.02 pad 1.88)
  other vias: 27.94,27.94
N$190  (via drill 1.02 pad 1.88)
  other vias: 27.94,25.4
N$191  (via drill 1.02 pad 1.88)
  other vias: 27.94,22.86
N$192  (via drill 1.02 pad 1.88)
  other vias: 27.94,20.32
N$193  (via drill 1.02 pad 1.88)
  other vias: 27.94,17.78
N$194  (via drill 1.02 pad 1.88)
  other vias: 27.94,15.24
N$195  (via drill 1.02 pad 1.88)
  other vias: 27.94,12.7
N$196  (via drill 1.02 pad 1.88)
  other vias: 27.94,10.16
N$227  (via drill 0.51)
  Top 0.254: S1.4 42.65,11.05 v42.57,11.12
  Bottom 0.254: U1.RES 24.13,3.81 25.4,5.08 37.21,5.08 42.57,10.44 v42.57,11.12
RESET  (via drill 0.51)
  Top 0.254: U3.7 41.66,18.16 v42.09,18.59 | U2.7 39.65,34.92 43.81,39.09 v43.81,39.24 43.81,46.35 41.91,48.26 U1.D5
  Bottom 0.254: v43.81,39.24 43.81,20.32 v42.09,18.59
RIGHT
  Top 0.254: 54.61,12.7 55.03,12.7 JP6.RING 53.34,13.06 | C3.1 53.34,13.06 | 53.34,13.06 53.34,20.7 55.39,22.75 JP1.RING 53.23,25.76 52.45,26.54 52.45,42.8 AUDIO_IN.3
STROBE  (via drill 0.51)
  Top 0.254: U2.4 32.77,32.21 v32.77,30.1 | U3.4 35.15,15.62 v35.18,15.6
  Bottom 0.254: v35.18,15.6 35.18,27.69 v32.77,30.1 32.77,30.23 44.45,41.91 U1.D4
VCC
  Top 0.254: U3.1 30.48,19.43 | 35.56,23.48 C7.1 32.37,23.48 30.48,21.59 30.48,19.43 | 35.56,23.48 R1.1 | 36.57,40.04 R2.1 36.56,40.06 C8.1 34.5,40.04 31.83,40.04 30.48,38.69 30.48,36.83 31.11,36.2 U2.1 34.92,36.2 35.56,35.56 35.56,23.48 | U1.5V 30.48,3.81 30.48,12.7 | 30.48,12.7 30.48,19.43 | R3.2 33.01,12.7 30.48,12.7

### Text on the board
Bottom: V16
tPlace: Audio In | L | G | R | Input | Output | Reset | Power
bPlace: Based on design by | Spectrum Shield | bliptronics.com
Measures: Center point to center point Stand Off distance | Center point to center point Stand Off distance
tDocu: Chris Taylor | Revised by: P. Alberts